# Altium schematic sheet Main.SchDoc
size B; SheetNumber: 1; SheetTotal: 1
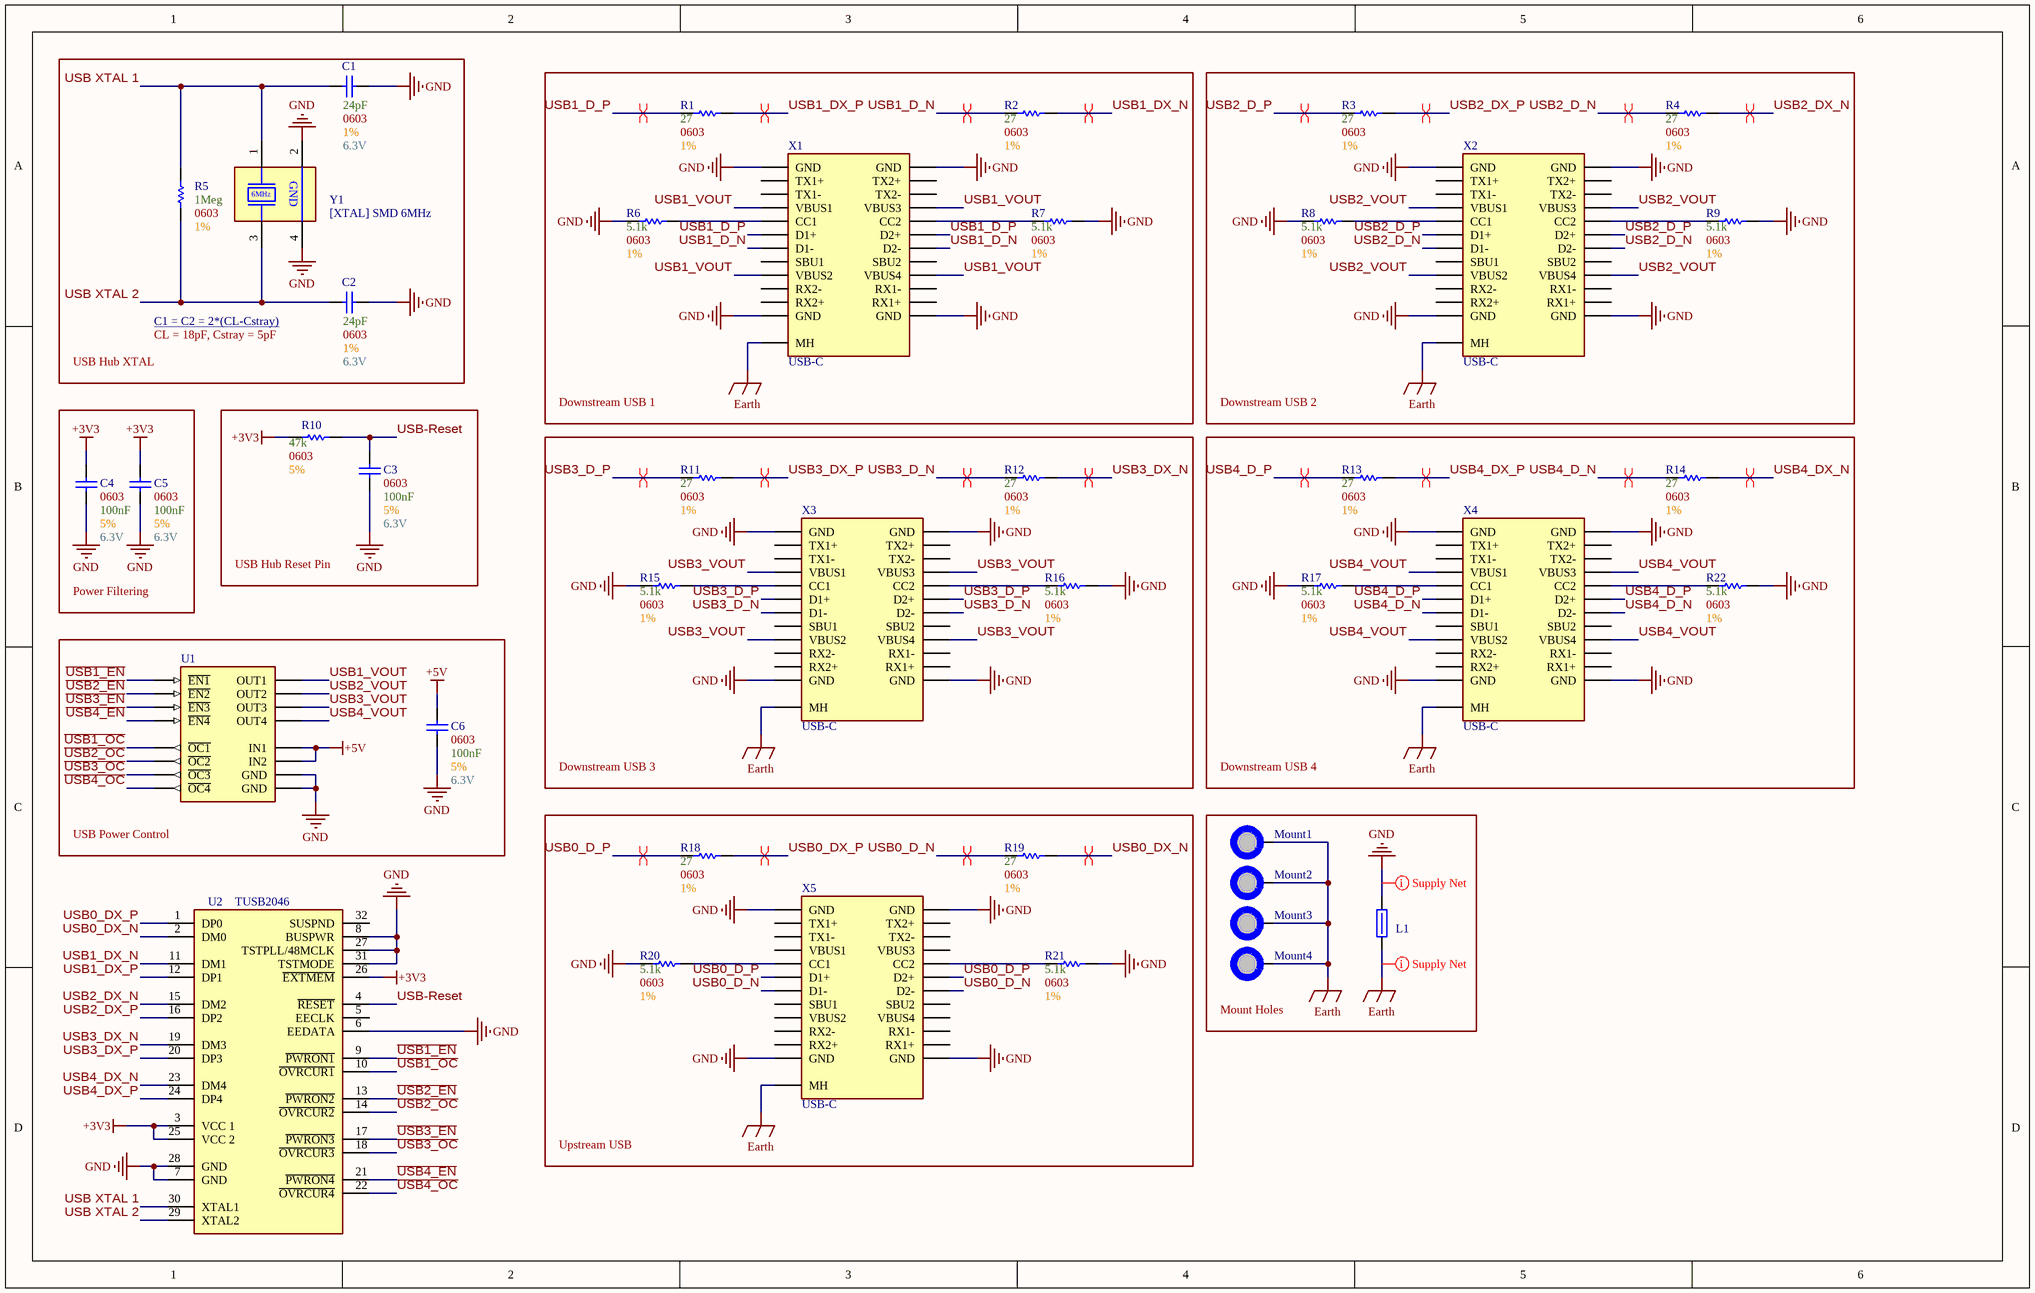
[diagram p0: Main.SchDoc]

## Parts
C1  Tolerance: 1%  Size Package: 0603  Capacitance: 24pF  Voltage: 6.3V  [[Cap] SMD 0603]  (hidden comment: SMD Nonpolarized)
C2  Tolerance: 1%  Size Package: 0603  Capacitance: 24pF  Voltage: 6.3V  [[Cap] SMD 0603]  (hidden comment: SMD Nonpolarized)
C3  Size Package: 0603  Capacitance: 100nF  Voltage: 6.3V  Tolerance: 5%  [[Cap] SMD 0603]  (hidden comment: [Cap] SMD Nonpolarized)
C4  Size Package: 0603  Capacitance: 100nF  Voltage: 6.3V  Tolerance: 5%  [[Cap] SMD 0603]  (hidden comment: [Cap] SMD Nonpolarized)
C5  Size Package: 0603  Capacitance: 100nF  Voltage: 6.3V  Tolerance: 5%  [[Cap] SMD 0603]  (hidden comment: [Cap] SMD Nonpolarized)
C6  Size Package: 0603  Capacitance: 100nF  Voltage: 6.3V  Tolerance: 5%  [[Cap] SMD 0603]  (hidden comment: [Cap] SMD Nonpolarized)
L1  652-MH2029-300Y  [[Ferrite] SMD Bead 0805 (1)]  (value not drawn)
Mount1  M3 Mount Hole  [[Mount] M3 Mount Hole]  (value not drawn)  (no BOM)
Mount2  M3 Mount Hole  [[Mount] M3 Mount Hole]  (value not drawn)  (no BOM)
Mount3  M3 Mount Hole  [[Mount] M3 Mount Hole]  (value not drawn)  (no BOM)
Mount4  M3 Mount Hole  [[Mount] M3 Mount Hole]  (value not drawn)  (no BOM)
R1  Tolerance: 1%  Resistance: 27  Size Package: 0603  [[Res] SMD 0603]  (hidden comment: [Res] SMD Resistor)
R2  Tolerance: 1%  Resistance: 27  Size Package: 0603  [[Res] SMD 0603]  (hidden comment: [Res] SMD Resistor)
R3  Tolerance: 1%  Resistance: 27  Size Package: 0603  [[Res] SMD 0603]  (hidden comment: [Res] SMD Resistor)
R4  Tolerance: 1%  Resistance: 27  Size Package: 0603  [[Res] SMD 0603]  (hidden comment: [Res] SMD Resistor)
R5  Tolerance: 1%  Resistance: 1Meg  Size Package: 0603  [[Res] SMD 0603]  (hidden comment: [Res] SMD Resistor)
R6  Tolerance: 1%  Resistance: 5.1k  Size Package: 0603  [[Res] SMD 0603]  (hidden comment: [Res] SMD Resistor)
R7  Tolerance: 1%  Resistance: 5.1k  Size Package: 0603  [[Res] SMD 0603]  (hidden comment: [Res] SMD Resistor)
R8  Tolerance: 1%  Resistance: 5.1k  Size Package: 0603  [[Res] SMD 0603]  (hidden comment: [Res] SMD Resistor)
R9  Tolerance: 1%  Resistance: 5.1k  Size Package: 0603  [[Res] SMD 0603]  (hidden comment: [Res] SMD Resistor)
R10  Tolerance: 5%  Resistance: 47k  Size Package: 0603  [[Res] SMD 0603]  (hidden comment: [Res] SMD Resistor)
R11  Tolerance: 1%  Resistance: 27  Size Package: 0603  [[Res] SMD 0603]  (hidden comment: [Res] SMD Resistor)
R12  Tolerance: 1%  Resistance: 27  Size Package: 0603  [[Res] SMD 0603]  (hidden comment: [Res] SMD Resistor)
R13  Tolerance: 1%  Resistance: 27  Size Package: 0603  [[Res] SMD 0603]  (hidden comment: [Res] SMD Resistor)
R14  Tolerance: 1%  Resistance: 27  Size Package: 0603  [[Res] SMD 0603]  (hidden comment: [Res] SMD Resistor)
R15  Tolerance: 1%  Resistance: 5.1k  Size Package: 0603  [[Res] SMD 0603]  (hidden comment: [Res] SMD Resistor)
R16  Tolerance: 1%  Resistance: 5.1k  Size Package: 0603  [[Res] SMD 0603]  (hidden comment: [Res] SMD Resistor)
R17  Tolerance: 1%  Resistance: 5.1k  Size Package: 0603  [[Res] SMD 0603]  (hidden comment: [Res] SMD Resistor)
R18  Tolerance: 1%  Resistance: 27  Size Package: 0603  [[Res] SMD 0603]  (hidden comment: [Res] SMD Resistor)
R19  Tolerance: 1%  Resistance: 27  Size Package: 0603  [[Res] SMD 0603]  (hidden comment: [Res] SMD Resistor)
R20  Tolerance: 1%  Resistance: 5.1k  Size Package: 0603  [[Res] SMD 0603]  (hidden comment: [Res] SMD Resistor)
R21  Tolerance: 1%  Resistance: 5.1k  Size Package: 0603  [[Res] SMD 0603]  (hidden comment: [Res] SMD Resistor)
R22  Tolerance: 1%  Resistance: 5.1k  Size Package: 0603  [[Res] SMD 0603]  (hidden comment: [Res] SMD Resistor)
U1  [IC] USB Hub Power Distribution  [[IC] USB Hub Power Distribution]  (value not drawn)
U2  TUSB2046  [[IC] USB Hub 4port (2)]
X1  USB-C  [[Port] USB-C]
X2  USB-C  [[Port] USB-C]
X3  USB-C  [[Port] USB-C]
X4  USB-C  [[Port] USB-C]
X5  USB-C  [[Port] USB-C]
Y1  [XTAL] SMD 6MHz  [[XTAL] SMD 6MHz]

## Blocks framed on the sheet
Downstream USB 1: R1 R2 R6 R7 X1
Downstream USB 2: R3 R4 R8 R9 X2
Power Filtering: C4 C5
USB Hub Reset Pin: C3 R10
Downstream USB 3: R11 R12 R15 R16 X3
Downstream USB 4: R13 R14 R17 R22 X4
USB Power Control: C6 U1
Upstream USB: R18-R21 X5
Mount Holes: L1 Mount1-Mount4

## Nets
+3V3: C4.2 C5.2 R10.1 U2.3(VCC_1) U2.25(VCC_2) U2.26(~{EXTMEM})
+5V: C6.2 U1.2(IN1) U1.6(IN2)
Earth: L1.1 Mount1.1 Mount2.1 Mount3.1 Mount4.1 X1.MH X2.MH X3.MH X4.MH X5.MH
GND: C1.2 C2.2 C3.1 C4.1 C5.1 C6.1 L1.2 R6.1 R7.2 R8.1 R9.2 R15.1 R16.2 R17.1 R20.1 R21.2 R22.2 U1.1(GND) U1.5(GND) U2.6(EEDATA) U2.7(GND) U2.8(BUSPWR) U2.27(TSTPLL/48MCLK) U2.28(GND) U2.31(TSTMODE) X1.A1(GND) X1.A12(GND) X1.B1(GND) X1.B12(GND) X2.A1(GND) X2.A12(GND) X2.B1(GND) X2.B12(GND) X3.A1(GND) X3.A12(GND) X3.B1(GND) X3.B12(GND) X4.A1(GND) X4.A12(GND) X4.B1(GND) X4.B12(GND) X5.A1(GND) X5.A12(GND) X5.B1(GND) X5.B12(GND) Y1.2(GND) Y1.4(GND)
~{USB1_EN}: U1.3(~{EN1}) U2.9(~{PWRON1})
~{USB1_OC}: U1.16(~{OC1}) U2.10(~{OVRCUR1})
~{USB2_EN}: U1.4(~{EN2}) U2.13(~{PWRON2})
~{USB2_OC}: U1.13(~{OC2}) U2.14(~{OVRCUR2})
~{USB3_EN}: U1.7(~{EN3}) U2.17(~{PWRON3})
~{USB3_OC}: U1.12(~{OC3}) U2.18(~{OVRCUR3})
~{USB4_EN}: U1.8(~{EN4}) U2.21(~{PWRON4})
~{USB4_OC}: U1.9(~{OC4}) U2.22(~{OVRCUR4})
USB0_D_N: R19.1 X5.A7(D1-) X5.B7(D2-)
USB0_D_P: R18.1 X5.A6(D1+) X5.B6(D2+)
USB0_DX_N: R19.2 U2.2(DM0)
USB0_DX_P: R18.2 U2.1(DP0)
USB1_D_N: R2.1 X1.A7(D1-) X1.B7(D2-)
USB1_D_P: R1.1 X1.A6(D1+) X1.B6(D2+)
USB1_DX_N: R2.2 U2.11(DM1)
USB1_DX_P: R1.2 U2.12(DP1)
USB1_VOUT: U1.15(OUT1) X1.A4(VBUS1) X1.A9(VBUS2) X1.B4(VBUS3) X1.B9(VBUS4)
USB2_D_N: R4.1 X2.A7(D1-) X2.B7(D2-)
USB2_D_P: R3.1 X2.A6(D1+) X2.B6(D2+)
USB2_DX_N: R4.2 U2.15(DM2)
USB2_DX_P: R3.2 U2.16(DP2)
USB2_VOUT: U1.14(OUT2) X2.A4(VBUS1) X2.A9(VBUS2) X2.B4(VBUS3) X2.B9(VBUS4)
USB3_D_N: R12.1 X3.A7(D1-) X3.B7(D2-)
USB3_D_P: R11.1 X3.A6(D1+) X3.B6(D2+)
USB3_DX_N: R12.2 U2.19(DM3)
USB3_DX_P: R11.2 U2.20(DP3)
USB3_VOUT: U1.11(OUT3) X3.A4(VBUS1) X3.A9(VBUS2) X3.B4(VBUS3) X3.B9(VBUS4)
USB4_D_N: R14.1 X4.A7(D1-) X4.B7(D2-)
USB4_D_P: R13.1 X4.A6(D1+) X4.B6(D2+)
USB4_DX_N: R14.2 U2.23(DM4)
USB4_DX_P: R13.2 U2.24(DP4)
USB4_VOUT: U1.10(OUT4) X4.A4(VBUS1) X4.A9(VBUS2) X4.B4(VBUS3) X4.B9(VBUS4)
USB XTAL 1: C1.1 R5.1 U2.30(XTAL1) Y1.1(XTAL1)
USB XTAL 2: C2.1 R5.2 U2.29(XTAL2) Y1.3(XTAL2)
USB-Reset: C3.2 R10.2 U2.4(~{RESET})
NetR6_2: R6.2 X1.A5(CC1)
NetR7_1: R7.1 X1.B5(CC2)
NetR8_2: R8.2 X2.A5(CC1)
NetR9_1: R9.1 X2.B5(CC2)
NetR15_2: R15.2 X3.A5(CC1)
NetR16_1: R16.1 X3.B5(CC2)
NetR17_2: R17.2 X4.A5(CC1)
NetR20_2: R20.2 X5.A5(CC1)
NetR21_1: R21.1 X5.B5(CC2)
NetR22_1: R22.1 X4.B5(CC2)

Not connected (* = marked no-connect by the designer): U2 5(EECLK) 32(SUSPND); X1 A2(TX1+) A3(TX1-) A8(SBU1) A10(RX2-) A11(RX2+) B2(TX2+) B3(TX2-) B8(SBU2) B10(RX1-) B11(RX1+); X2 A2(TX1+) A3(TX1-) A8(SBU1) A10(RX2-) A11(RX2+) B2(TX2+) B3(TX2-) B8(SBU2) B10(RX1-) B11(RX1+); X3 A2(TX1+) A3(TX1-) A8(SBU1) A10(RX2-) A11(RX2+) B2(TX2+) B3(TX2-) B8(SBU2) B10(RX1-) B11(RX1+); X4 A2(TX1+) A3(TX1-) A8(SBU1) A10(RX2-) A11(RX2+) B2(TX2+) B3(TX2-) B8(SBU2) B10(RX1-) B11(RX1+); X5 A2(TX1+) A3(TX1-) A4(VBUS1) A8(SBU1) A9(VBUS2) A10(RX2-) A11(RX2+) B2(TX2+) B3(TX2-) B4(VBUS3) B8(SBU2) B9(VBUS4) B10(RX1-) B11(RX1+)

## Layout directives
differential pair; differential pair class USB_Pairs: USB0_D_N, USB0_D_P, USB0_DX_N, USB0_DX_P, USB1_D_N, USB1_D_P, USB1_DX_N, USB1_DX_P, USB2_D_N, USB2_D_P, USB2_DX_N, USB2_DX_P, USB3_D_N, USB3_D_P, USB3_DX_N, USB3_DX_P, USB4_D_N, USB4_D_P, USB4_DX_N, USB4_DX_P
net class Supply_Nets: Earth, GND

## Notes on the sheet
- USB Hub XTAL
- (near C2) C1 = C2 = 2*(CL-Cstray) <https://microchip.my.site.com/s/article/Calculating-crystal-load-capacitor>
- CL = 18pF, Cstray = 5pF
- (in symbol [XTAL] SMD 6MHz) 6MHz

## Library data of the parts
C1 C2 = [Cap] SMD Nonpolarized: Supplier 1: DigiKey; Supplier Part Number 1: 490-GCM1885C2A240JA16DCT-ND
L1 = [Ferrite] SMD Ferrite Bead (1): Res @ Freq: 30 @ 100MHz; Size Package: 0805
Mount1-Mount4 = [Mount] M3 Mount Hole: Place at least 4.5mm from board edge. Plated.
R1-R22 = [Res] SMD Resistor: Generic; Supplier 1: DigiKey
  R1-R4 R11-R14 R18 R19: Supplier Part Number 1: 749-1631-1-ND
  R5: Supplier Part Number 1: YAG4498CT-ND
  R6-R9 R15-R17 R20-R22: Supplier Part Number 1: 311-5.10KHRDKR-ND
  R10: Supplier Part Number 1: 311-4.70KHRDKR-ND
U2 = [IC] USB Hub 4port (2): TUSB2046BVFR; Supplier 1: DigiKey; Supplier Part Number 1: 296-27131-1-ND
X1-X5 = [Port] USB Type-C: Supplier 1: DigiKey; Supplier Part Number 1: 670-3104-1-ND
Y1 = [XTAL] SMD 6MHz: ECS-060-18-20BM-JEN-TR; Supplier 1: DigiKey; Supplier Part Number 1: XC2349CT-ND
C3-C6 = [Cap] SMD Nonpolarized: Supplier 1: DigiKey; Supplier Part Number 1: 311-1088-6-ND
U1 = [IC] USB Hub Power Distribution: Supplier 1: DigiKey; Supplier Part Number 1: 296-26909-1-ND